# Altium schematic sheet Sheet1.SchDoc
size A4; SheetNumber: 1; SheetTotal: 1; SPICEModelCacheKOTXBZJR: <root> / <DocumentId>KOTXBZJR</DocumentId> / </root>
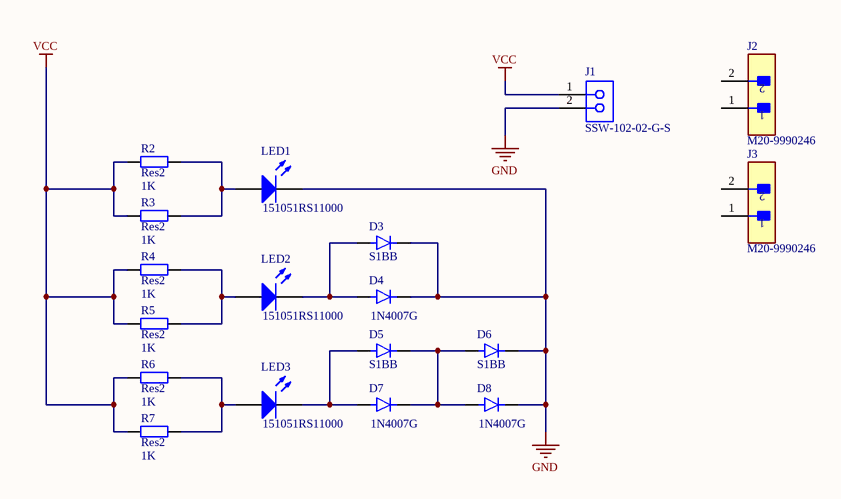
[diagram p0: Sheet1.SchDoc]

## Parts
D3  S1BB  [DIOM4336X265N]
D4  1N4007G  [DIOAD1036W78L470D235]
D5  S1BB  [DIOM4336X265N]
D6  S1BB  [DIOM4336X265N]
D7  1N4007G  [DIOAD1036W78L470D235]
D8  1N4007G  [DIOAD1036W78L470D235]
J1  SSW-102-02-G-S  [SMTC-SSW-102-02-X-S]
J2  M20-9990246  [FP-M20-9990246-MFG]
J3  M20-9990246  [FP-M20-9990246-MFG]
LED1  151051RS11000  [Type 5mm]
LED2  151051RS11000  [Type 5mm]
LED3  151051RS11000  [Type 5mm]
R2  Res2  value 1K  [AXIAL-0.5]
R3  Res2  value 1K  [C1206]
R4  Res2  value 1K  [AXIAL-0.5]
R5  Res2  value 1K  [C1206]
R6  Res2  value 1K  [AXIAL-0.5]
R7  Res2  value 1K  [C1206]

## Nets
GND: D3.C(K) D4.C(K) D6.C(K) D8.C(K) J1.2 LED1.1(K)
VCC: J1.1 R2.1 R3.1 R4.1 R5.1 R6.1 R7.1
NetD3_A: D3.A D4.A LED2.1(K)
NetD5_A: D5.A D7.A LED3.1(K)
NetD5_C: D5.C(K) D6.A D7.C(K) D8.A
NetLED1_2: LED1.2(A) R2.2 R3.2
NetLED2_2: LED2.2(A) R4.2 R5.2
NetLED3_2: LED3.2(A) R6.2 R7.2

Not connected (* = marked no-connect by the designer): J2 1 2; J3 1 2

## Library data of the parts
D3 D5 D6 = S1BB: MF: {'manufacturer': u'Taiwan Semiconductor'}; Availability: Unavailable; Package: None; MP: S1BB; Value: *; Price: None
D4 D7 D8 = 1N4007G: MF: {'manufacturer': u'ON Semiconductor'}; Price: None; Availability: Unavailable; Value: *; MP: 1N4007G; Package: None
J1 = CMP-1023-00324-1: SQ Post Socket, Through-hole, Vertical, -55 to 125 degC, 2.54 mm Pitch, 2-Pin, Female, RoHS; Manufacturer: Samtec; Pitch: 2.54 mm; Temperature Range: -55 to 125 degC; DatasheetVersion: F-214; PartNumber: SSW-102-02-G-S; Orientation: Vertical; RoHS: True; PackageReference: SSW-102-02-X-S; PackageVersion: CA, 6/1987; ComponentLink2Description: Datasheet; ComponentLink2URL: http://www.samtec.com/documents/webfiles/pdf/SSW_TH.PDF; PackageDescription: Assembly, Socket Strip .016 X .031 Tail; Mounting Technology: Through-hole; ComponentLink1URL: http://www.samtec.com; ComponentLink3URL: http://www.samtec.com/documents/webfiles/cpdf/SSW-1XX-XX-XXX-X-XX-XXX-XX-MKT.pdf; ComponentLink3Description: Package Specification; ComponentLink1Description: Manufacturer URL
J2 J3 = CMP-15831-000009-1: CONN HEADER VERT 2POS 2.54MM; Manufacturer: Harwin; Conn Gender: Male; Description: Connector Header Through Hole 2 position 0.100" (2.54mm); Conn Orientation: Vertical; Number Of Contacts: 2; Current Rating: 3A; ComponentLink2URL: https://cdn.harwin.com/pdfs/M20-999.pdf; ComponentLink2Description: Datasheet; Package: M20-9990246; Temperature: -40°C to +105°C; Octopart: https://octopart.com/m20-9990246-harwin-2590635; Mouser Description: 2.54mm (0.1") Pitch SIL Vertical PC Tail Pin Header, 6.1mm mating pin height, tin, 2 contacts; Temperature Range High: +105°C; Device Class L1: Connectors; RoHS: TRUE; Automotive: No; Height: 8.99mm; Number Of Rows: 1; Contact Material: Tin,Nickel; Category: Conn; Pitch: 2.54mm; Lead Free: Yes; Digikey Description: CONN HEADER VERT 2POS 2.54MM; Manufacturer Part Number: M20-9990246; Temperature Range Low: -40°C; Device Class L3: unset; Device Class L2: Headers and Wire Housings
LED1-LED3 = CMP-1488-00008-1: THT LED round mono-color color lens, WL-TMRW, Red; Manufacturer: Wuerth Elektronik; PackageReference: Type 5mm; PartNumber: 151051RS11000; ComponentLink2URL: http://katalog.we-online.de/pbs/datasheet/7448042001.pdfhttp://katalog.we-online.de/pbs/datasheet/7448042001.pdfhttp://katalog.we-online.de/pbs/datasheet/7448042001.pdfhttp://katalog.we-online.de/pbs/datasheet/151051RS11000.pdf; ComponentLink1URL: http://www.we-online.com; ComponentLink1Description: Manufacturer URL; ComponentLink2Description: Datasheet; Emitting color: Red
R2-R7 = Res2: Resistor; Published: 8-Jun-2000; LatestRevisionDate: 17-Jul-2002; LatestRevisionNote: Re-released for DXP Platform.; PackageReference: AXIAL-0.4; Publisher: Altium Limited; PackageDescription: Axial Device, Thru-Hole; 2 Leads; 0.4 in Pin Spacing